# EasyEDA Pro project PowerManager.eprj

# Schematic Schematic1
Create Date: 2024-06-30; Page Name: P1; Project Name: PowerManager; Schematic Name: Schematic1; Update Date: 2024-07-01; Company: 嘉立创EDA; Page Size: A4; Version: V1.0
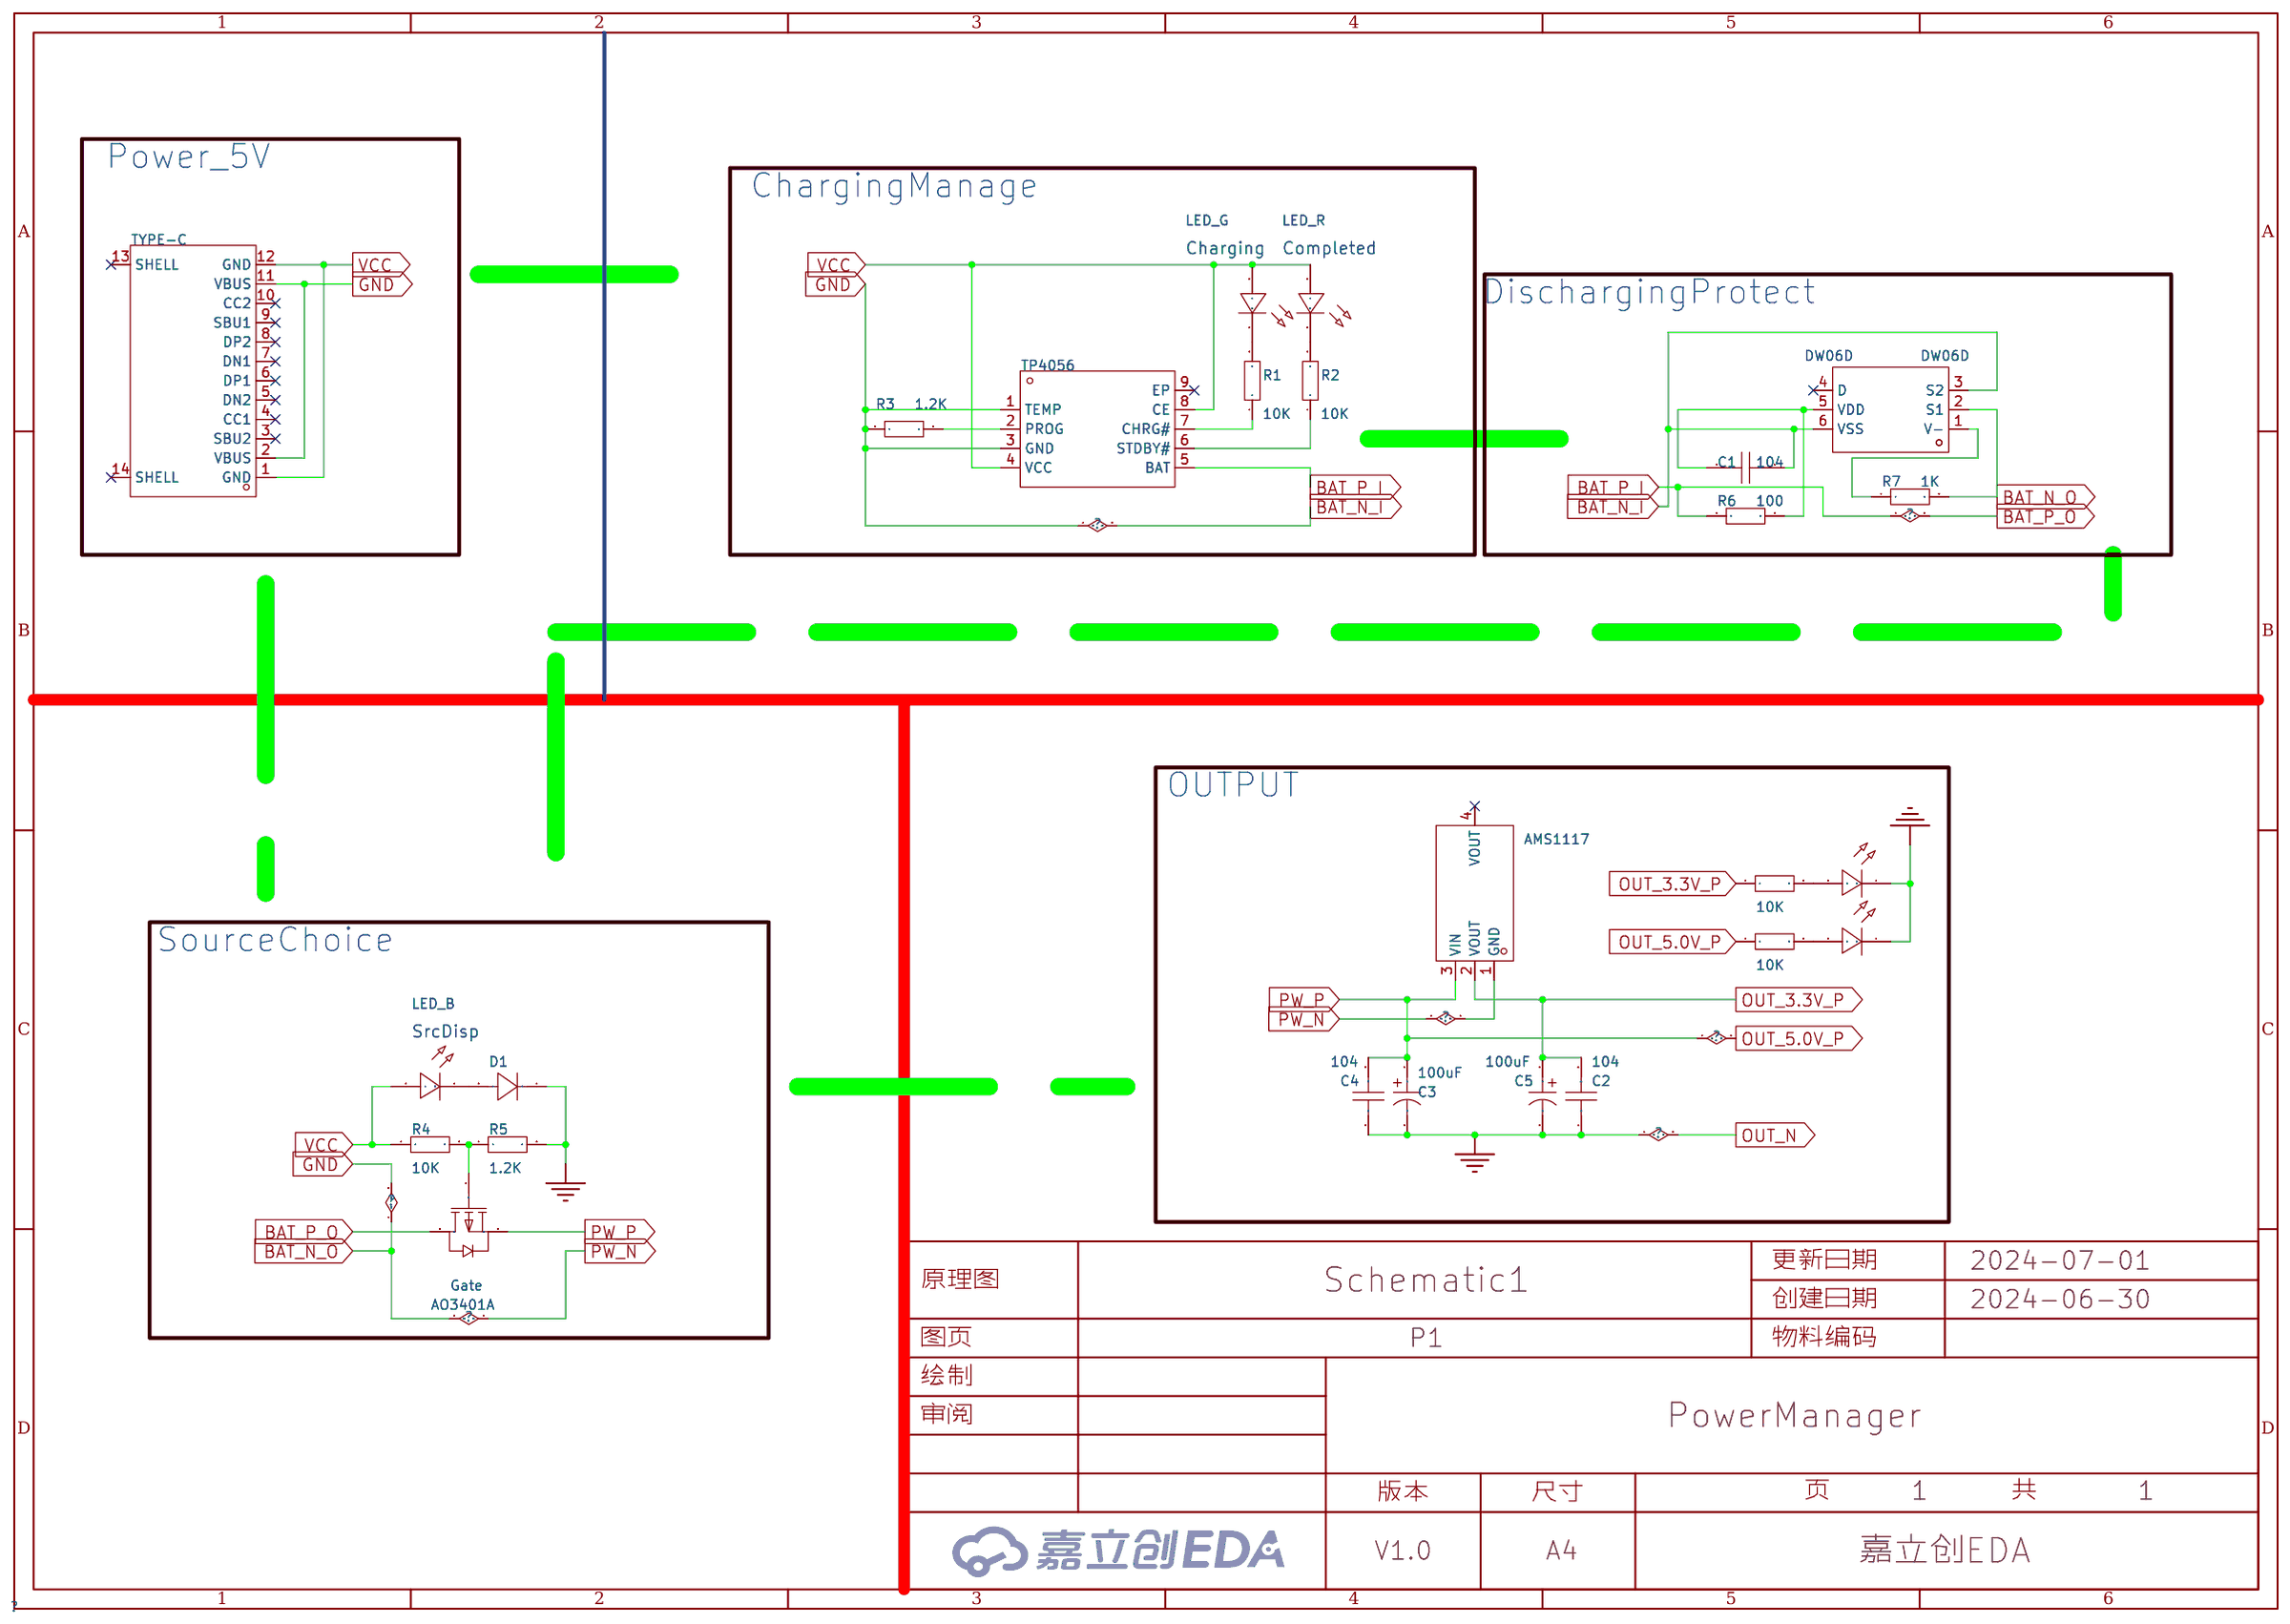
[diagram p0: schematic sheet]

## Parts
AMS1117  AMS1117  [SOT-223-3_L6.5-W3.4-P2.30-LS7.0-BR]
C1  104  [C0603]
C2  104  [C0603]
C3  100uF  [CAP-SMD_L7.3-W4.3-L-FD_EEFSX0E471E4]
C4  104  [C0603]
C5  100uF  [CAP-SMD_L7.3-W4.3-L-FD_EEFSX0E471E4]
Charging  LED_G  [LED_0603]
Completed  LED_R  [LED_0603]
D1  -  [SMA_1N4007]
DW06D  DW06D  [SOT-23-6_L2.9-W1.6-P0.95-LS2.8-BR]
Gate  AO3401A  [SOT-23_L2.9-W1.3-P1.90-LS2.4-BR]
LED1  -  [LED_0603]
LED2  -  [LED_0603]
R1  10K  [R0603]
R2  10K  [R0603]
R3  1.2K  [R0603]
R4  10K  [R0603]
R5  1.2K  [R0603]
R6  100  [R0603]
R7  1K  [R0603]
R8  10K  [R0603]
R9  10K  [R0603]
SrcDisp  LED_B  [LED_0603]
TP4056  TP4056  [ESOP-8_L4.9-W3.9-P1.27-LS6.0-BL-EP]
Type-C  TYPE-C  [USB-C-SMD_TYPE-C-6PIN-2MD-073]

## Library data of the parts
AMS1117 = AMS1117-3.3_C6186: 输出类型:固定;最大输入电压:-;输出电压:3.3V;最大输出电流:1A;电源纹波抑制比(PSRR):72dB@(120Hz);输出极性:正极;; LCSC Part Name: 输出3.3V 1A; Supplier Part: C6186; Manufacturer: AMS; Supplier Footprint: SOT-223; Datasheet: https://atta.szlcsc.com/upload/public/pdf/source/20180727/C6186_7A095716F0823C02F1997A905E26C086.pdf; Supplier: LCSC; Output Type: 固定; Output Voltage: 3.3V; MAX Output Current: 1A; Power Supply Rejection Ratio (PSRR): 72dB@(120Hz); Dropout Voltage: 1.3V@(800mA); Output Polarity: 正极; Number of Outputs: 1
C1 C2 C4 = CAP_0603: Supplier Footprint: 0603
C3 C5 = TR3D107K016C0150: 容值:100uF;精度:±10%;额定电压:16V;等效串联电阻:150mΩ;; LCSC Part Name: 100uF ±10% 16V; Supplier Part: C1953348; Manufacturer: VISHAY(威世); Supplier Footprint: CASE-D-7343-31(mm); Datasheet: https://atta.szlcsc.com/upload/public/pdf/source/20210424/D2589FD6E35F2EE55A4FE29C9A2BF604.pdf; Supplier: LCSC; Tolerance: ±10%; Rated Voltage: 16V; Equivalent Series Resistance(ESR): 150mΩ; Operating Temperature: -55℃~+125℃
Charging Completed LED1 LED2 SrcDisp = LED_0603-R: Supplier Footprint: 0603
D1 = D_1N4007: Supplier Footprint: SMA
DW06D = DW06D/J: 二合一锂电池保护 IC; Supplier Part: C82123; Manufacturer: FM(富满); Supplier Footprint: SOT-23-6; Datasheet: https://atta.szlcsc.com/upload/public/pdf/source/20160903/1472896624271.pdf; Supplier: LCSC
Gate = AO3401A_C15127: 类型:1个P沟道;漏源电压(Vdss):30V;连续漏极电流(Id):4A;功率(Pd):1.4W;导通电阻(RDS(on)@Vgs,Id):44mΩ@10V,4.3A;阈值电压(Vgs(th)@Id):1.3V@250uA;; LCSC Part Name: 1个P沟道 耐压:30V 电流:4A; Supplier Part: C15127; Manufacturer: AOS; Supplier Footprint: SOT-23; Datasheet: https://atta.szlcsc.com/upload/public/pdf/source/20160507/1462613609053.pdf; Supplier: LCSC; Type: 1个P沟道; Drain Source Voltage (Vdss): 30V; Continuous Drain Current (Id): 4A; Power Dissipation (Pd): 1.4W; Drain Source On Resistance (RDS(on)@Vgs,Id): 44mΩ@10V,4.3A; Gate Threshold Voltage (Vgs(th)@Id): 1.3V@250uA; Total Gate Charge (Qg@Vgs): 12.2nC@4.5V; Input Capacitance (Ciss@Vds): 1.2nF@15V; Operating Temperature: -55℃~+150℃@(Tj)
R1-R9 = Res_0603: Supplier Footprint: 0603
TP4056 = TP4056_C725790: Supplier Part: C725790; Manufacturer: UMW(友台半导体); Supplier Footprint: ESOP-8; Datasheet: https://atta.szlcsc.com/upload/public/pdf/source/20231109/CF74897CE79A500F7FE27A45ADCCC631.pdf; Supplier: LCSC
Type-C = TYPE-C 16PIN 2MD(073): 连接器类型:Type-C;标准:-;公母:母;端口数量:1;触点数量:16P;安装方式:卧贴;额定电流 - 电源:5A;工作温度范围:-25℃~+85℃;; LCSC Part Name: Type-C 母 卧贴; Supplier Part: C2765186; Manufacturer: SHOU HAN(首韩); Supplier Footprint: SMD; Datasheet: https://atta.szlcsc.com/upload/public/pdf/source/20211123/39B17C16241EAC15C5E277BDA434118E.pdf; Supplier: LCSC; Gender: 母; Number of Ports: 1; Number of Contacts: 16P; Mounting Style: 卧贴; Current Rating - Power (Max): 5A; Operating Temperature Range: -25℃~+85℃

## Nets
GND: AMS1117.1(GND) C1.1 C2.1 C3.2 C4.1 C5.2 D1.1(K) DW06D.2(S1) DW06D.3(S2) DW06D.6(VSS) LED1.1(C) LED2.1(C) R3.1 R5.2 R7.2 TP4056.1(TEMP) TP4056.3(GND) Type-C.2(VBUS) Type-C.11(VBUS)
VCC: Charging.2(A) Completed.2(A) R4.1 SrcDisp.2(A) TP4056.4(VCC) TP4056.8(CE) Type-C.1(GND) Type-C.12(GND)
BAT_P_I: Gate.3(D) R6.1 TP4056.5(BAT)
OUT_3.3V_P: AMS1117.2(VOUT) C2.2 C5.1 R8.1
OUT_5.0V_P: AMS1117.3(VIN) C3.1 C4.2 Gate.2(S) R9.1
$1N753: R3.2 TP4056.2(PROG)
$1N897: Completed.1(C) R2.2
$1N964: Charging.1(C) R1.2
$1N968: R1.1 TP4056.7(CHRG#)
$1N975: R2.1 TP4056.6(STDBY#)
$1N1874: Gate.1(G) R4.2 R5.1
$1N2995: DW06D.1(V-) R7.1
$1N3321: C1.2 DW06D.5(VDD) R6.2
$1N6420: D1.2(A) SrcDisp.1(C)
Net-(LED1-2): LED1.2(A) R8.2
Net-(LED2-2): LED2.2(A) R9.2

Not connected (* = marked no-connect by the designer): AMS1117 4(VOUT)*; DW06D 4(D)*; TP4056 9(EP)*; Type-C 3(SBU2)* 4(CC1)* 5(DN2)* 6(DP1)* 7(DN1)* 8(DP2)* 9(SBU1)* 10(CC2)* 13(SHELL)* 14(SHELL)*

## Notes on the sheet
- Power_5V
- ChargingManage
- DischargingProtect
- OUTPUT
- SourceChoice

# Board PCB1
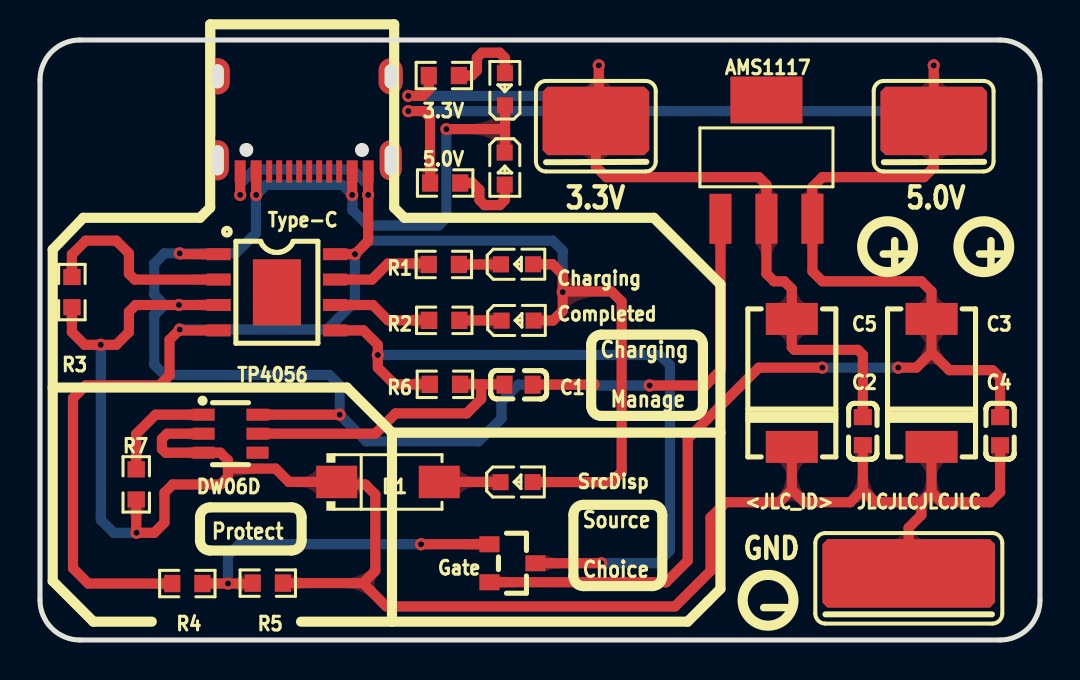
[diagram p1: board, top side]
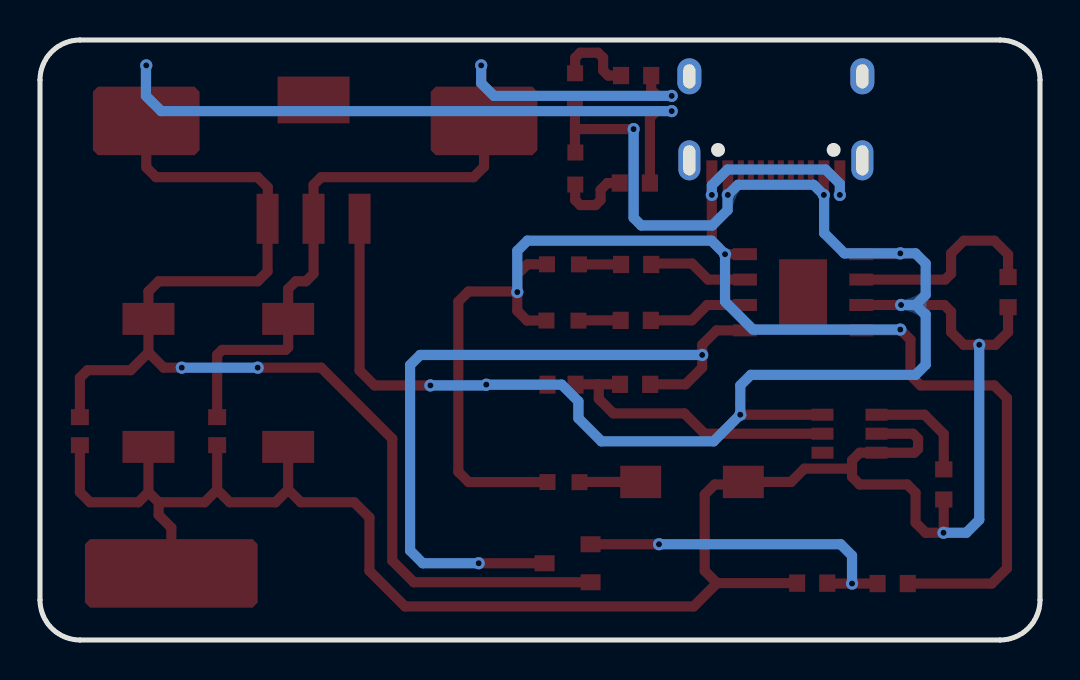
[diagram p2: board, bottom side, seen from below]

Outline 50 x 30 mm; copper layers: Top Layer, Bottom Layer. Coordinates in mm from the lower left corner of the outline.
Outline path: 0,28 0,2 arc(0.59,0.59) 2,0 48,0 arc(49.41,0.59) 50,2 50,28 arc(49.41,29.41) 48,30 2,30 arc(0.59,29.41) 0,28
Stack: Top Layer 0.035mm / Dielectric1 1.51mm FR4 er 4.5 / Bottom Layer 0.035mm

## Design rules (mm)
template: JLCPCB Capability(Two Layers Board)
spacing copperThickness1oz (default): track to track 0.102, other pairs 0.152 to 0.3
spacing copperThickness2oz: track to track 0.203, other pairs 0.152 to 0.3
track width copperThickness1oz (default): min 0.127, default 0.254, max 2.54
track width copperThickness2oz: min 0.203, default 0.254, max 2.54
differential pair differentialPair (default): width min 0.127, default 0.254, max 2.54; gap min 0.152, default 0.152
via viaSize (default): diameter min 0.5, default 0.61, max 10; hole min 0.3, default 0.305, max 6.3

## Placement (name value [footprint] x y rotation side)
3.3V  -  [LED_0603]  23.24 27.59 90 top
5.0V  -  [LED_0603]  23.24 23.52 270 top
AMS1117  AMS1117  [SOT-223-3_L6.5-W3.4-P2.30-LS7.0-BR]  36.32 24.03 270 top
C1  104  [C0603]  23.93 12.77 180 top
C2  104  [C0603]  41.14 10.44 90 top
C3  100uF  [CAP-SMD_L7.3-W4.3-L-FD_EEFSX0E471E4]  44.58 12.86 270 top
C4  104  [C0603]  48.01 10.44 90 top
C5  100uF  [CAP-SMD_L7.3-W4.3-L-FD_EEFSX0E471E4]  37.59 12.86 270 top
Charging  LED_G  [LED_0603]  23.9 18.79 0 top
Completed  LED_R  [LED_0603]  23.93 15.98 0 top
D1  -  [SMA_1N4007]  17.4 7.9 0 top
DW06D  DW06D  [SOT-23-6_L2.9-W1.6-P0.95-LS2.8-BR]  9.53 10.31 180 top
Gate  AO3401A  [SOT-23_L2.9-W1.3-P1.90-LS2.4-BR]  23.62 3.84 180 top
NOREF  -  [Pad_e75]  44.69 25.95 0 top
NOREF#2  -  [Pad_e67]  43.43 3.33 0 top
NOREF#3  -  [Pad_e86]  27.8 25.95 0 top
R1  10K  [R0603]  20.19 18.78 0 top
R2  10K  [R0603]  20.21 15.98 0 top
R3  1.2K  [R0603]  1.6 17.39 90 top
R4  10K  [R0603]  7.37 2.82 0 top
R5  1.2K  [R0603]  11.39 2.84 0 top
R6  100  [R0603]  20.25 12.78 0 top
R7  1K  [R0603]  4.81 7.78 270 top
R8  10K  [R0603]  20.19 28.22 0 top
R9  10K  [R0603]  20.26 22.85 0 top
SrcDisp  LED_B  [LED_0603]  23.88 7.9 0 top
TP4056  TP4056  [ESOP-8_L4.9-W3.9-P1.27-LS6.0-BL-EP]  11.85 17.39 270 top
Type-C  TYPE-C  [USB-C-SMD_TYPE-C-6PIN-2MD-073]  13.21 25.81 180 top

## Footprints (pads in the part's own frame, mm; a bottom-side part is the same pattern mirrored in y, then rotated)
C0603
  rect 0.8x0.9 smd: 1(-0.7,0) 2(0.7,0)
CAP-SMD_L7.3-W4.3-L-FD_EEFSX0E471E4
  rect 1.6x2.6 smd: 1(-3.2,0) 2(3.2,0)
ESOP-8_L4.9-W3.9-P1.27-LS6.0-BL-EP
  rect 0.6x1.2 smd: 1(-1.905,-2.909) 2(-0.635,-2.909) 3(0.635,-2.909) 4(1.905,-2.909) 5(1.905,2.909) 6(0.635,2.909) 7(-0.635,2.909) 8(-1.905,2.909)
  rect 3.3x2.4 smd: 9(0,0)
LED_0603
  rect 0.8x0.8 smd: 1(-0.851,-0.01) 2(0.75,-0.005)
Pad_e67
  custom 8.636x3.429 smd: 17(0,0)
Pad_e75
  custom 5.334x3.429 smd: 16(0,0)
Pad_e86
  custom 5.334x3.429 smd: 15(0,0)
R0603
  rect 0.806x0.864 smd: 1(-0.753,0) 2(0.753,0)
SMA_1N4007
  rect 2.046x1.62 smd: 1(-2.566,0) 2(2.566,0)
SOT-23-6_L2.9-W1.6-P0.95-LS2.8-BR
  rect 1.1x0.6 smd: 1(1.35,-0.95) 2(1.35,0) 3(1.35,0.95) 4(-1.35,0.95) 5(-1.35,0) 6(-1.35,-0.95)
SOT-23_L2.9-W1.3-P1.90-LS2.4-BR
  rect 1x0.8 smd: 1(1.15,-0.95) 2(1.15,0.95) 3(-1.15,0)
SOT-223-3_L6.5-W3.4-P2.30-LS7.0-BR
  rect 2.5x1.1 smd: 1(2.97,-2.3) 2(2.97,0) 3(2.97,2.3)
  rect 2.34x3.6 smd: 4(-2.97,0)
USB-C-SMD_TYPE-C-6PIN-2MD-073
  rect 0.55x1.1 smd: 1(-3.2,2.375) 2(-2.4,2.375) 11(2.4,2.375) 12(3.2,2.375)
  rect 0.3x1.1 smd: 3(-1.75,2.375) 4(-1.25,2.375) 5(-0.75,2.375) 6(-0.25,2.375) 7(0.25,2.375) 8(0.75,2.375) 9(1.25,2.375) 10(1.75,2.375)
  oval 1.1x2 hole 0.6x1.5: 13(-4.325,1.825) 14(4.325,1.825)
  oval 1.2x1.8 hole 0.6x1.2: 13(-4.325,-2.375) 14(4.325,-2.375)

## Nets
GND: 3.3V.1 5.0V.1 AMS1117.1 C1.1 C2.1 C3.2 C4.1 C5.2 D1.1 DW06D.2 DW06D.3 DW06D.6 NOREF#2.17 R3.1 R5.2 R7.2 TP4056.1 TP4056.3 Type-C.2 Type-C.11
VCC: Charging.2 Completed.2 R4.1 SrcDisp.2 TP4056.4 TP4056.8 Type-C.1 Type-C.12
BAT_P_I: Gate.3 R6.1 TP4056.5
OUT_3.3V_P: AMS1117.2 C2.2 C5.1 NOREF#3.15 R8.1
OUT_5.0V_P: AMS1117.3 C3.1 C4.2 Gate.2 NOREF.16 R9.1
$1N753: R3.2 TP4056.2
$1N897: Completed.1 R2.2
$1N964: Charging.1 R1.2
$1N968: R1.1 TP4056.7
$1N975: R2.1 TP4056.6
$1N1874: Gate.1 R4.2 R5.1
$1N2995: DW06D.1 R7.1
$1N3321: C1.2 DW06D.5 R6.2
$1N6420: D1.2 SrcDisp.1
$1N7526: 3.3V.2 R8.2
$1N7553: 5.0V.2 R9.2

Pads without a net: AMS1117 4; DW06D 4; TP4056 9; Type-C 3 4 5 6 7 8 9 10 13 14

## Via types
v1: diameter 0.61, hole 0.305, Top Layer to Bottom Layer, 25 vias

## Routing (per net, layer and track width the routed paths; a pad name or vN(x,y) marks a point on that pad's centre or on a via; arc(x,y) is an arc through that point)
GND: length 190
  Top Layer w0.508: 41.14,7.52 41.77,6.89 44.07,6.89 ; 41.14,7.52 40.51,6.89 38.23,6.89 37.59,7.52 ; 41.14,7.52 C2.1 ; v1(30.48,12.73) 33.27,12.73 34.02,13.48 AMS1117.1 ; 8.94,16.75 v1(6.95,16.75) 4.78,16.75 4.44,16.41 4.44,15.39 3.81,14.76 v1(3.04,14.76) 2.23,14.76 1.6,15.39 1.6,16.51 ; R7.2 4.81,5.38 v1(4.83,5.36) 5.72,5.36 6.22,5.87 6.22,7.36 6.64,7.78 9.02,7.78 9.4,8.16 9.4,8.57 ; 9.4,8.57 11.78,8.57 12.45,7.9 D1.1 14.96,7.78 16.26,7.78 16.76,7.28 16.76,3.46 16.15,2.84 ; 9.4,8.57 9.4,8.98 9.02,9.36 DW06D.3 6.28,9.36 6.1,9.55 6.1,10.06 6.35,10.31 DW06D.2 ; 37.59,7.52 36.96,6.89 34.29,6.89 33.53,6.12 33.53,3.46 31.75,1.68 17.31,1.68 16.15,2.84 ; 37.59,7.52 C5.2 ; C1.1 v1(27.69,12.77) ; NOREF#2.17 43.43,5.62 44.07,6.25 44.07,6.89 ; 3.3V.1 23.25,25.55 ; 23.25,25.55 v1(20.32,25.55) ; 23.25,25.55 23.25,24.39 5.0V.1 ; 16.15,2.84 R5.2 ; 44.58,7.39 C3.2 ; 44.58,7.39 44.07,6.89 ; 44.58,7.39 45.09,6.89 47.5,6.89 48.01,7.39 C4.1 ; Type-C.2 v1(15.61,22.25) ; v1(6.98,19.33) 7.03,19.29 8.94,19.29 ; v1(14.99,11.27) DW06D.6 ; Type-C.11 v1(10.81,22.25)
  Bottom Layer w0.508: v1(20.32,25.55) 20.32,21.11 19.94,20.73 16.38,20.73 15.62,21.49 15.62,22.24 v1(15.61,22.25) 15.1,22.76 11.32,22.76 v1(10.81,22.25) 10.79,22.24 10.79,20.35 9.78,19.33 v1(6.98,19.33) 6.22,19.33 5.72,18.82 5.72,17.26 6.22,16.75 ; v1(6.95,16.75) 6.22,16.75 ; 6.22,16.75 5.76,16.28 5.72,16.28 5.72,13.76 6.22,13.26 14.46,13.26 14.99,12.73 v1(14.99,11.27) 16.32,9.93 21.93,9.93 23.08,11.09 23.08,11.93 23.91,12.77 v1(27.69,12.77) 27.72,12.73 v1(30.48,12.73) ; v1(3.04,14.76) 3.04,6.01 3.68,5.36 v1(4.83,5.36)
VCC: length 84.4
  Top Layer w0.508: R4.1 2.41,2.82 1.65,3.58 1.65,12.09 2.29,12.73 5.97,12.73 6.48,13.24 6.48,15.01 v1(6.98,15.52) 7.03,15.48 8.94,15.48 ; v1(26.14,17.4) 26.14,18.28 25.63,18.79 Charging.2 ; v1(26.14,17.4) 26.14,16.46 25.65,15.97 Completed.2 ; v1(26.14,17.4) 26.17,17.43 28.57,17.43 29.08,16.92 29.08,8.41 28.57,7.9 SrcDisp.2 ; TP4056.8 v1(15.75,19.29) 16.41,19.95 v1(16.41,22.25) Type-C.1 ; Type-C.12 v1(10.01,22.25)
  Bottom Layer w0.508: v1(10.01,22.25) 10.01,22.81 10.72,23.52 15.62,23.52 16.41,22.74 v1(16.41,22.25) ; v1(26.14,17.4) 26.14,19.46 25.63,19.97 16.42,19.97 v1(15.75,19.29) 15.75,16.92 14.35,15.52 v1(6.98,15.52)
BAT_P_I: length 37.6
  Top Layer w0.508: TP4056.5 16.17,15.48 16.89,14.76 v1(16.89,14.25) 16.89,13.62 17.72,12.78 R6.1 ; v1(28.07,3.84) Gate.3
  Bottom Layer w0.508: v1(16.89,14.25) 30.99,14.25 31.5,13.74 31.5,4.47 30.86,3.84 v1(28.07,3.84)
OUT_3.3V_P: length 42.3
  Top Layer w0.508: C2.2 41.14,14.26 40.89,14.51 37.72,14.51 37.59,14.63 C5.1 37.59,17.55 37.21,17.94 36.7,17.94 36.32,18.32 AMS1117.2 36.32,22.76 35.94,23.14 28.32,23.14 27.8,23.67 NOREF#3.15 27.94,26.1 v1(27.94,28.73) ; R8.1 19.44,27.51 19.13,27.21 v1(18.41,27.21)
  Bottom Layer w0.508: v1(18.41,27.21) 27.31,27.21 27.94,27.84 v1(27.94,28.73)
OUT_5.0V_P: length 94.2
  Top Layer w0.508: Gate.2 31.31,2.89 32.38,3.97 32.38,10.06 35.94,13.62 v1(39.12,13.62) ; R9.1 19.5,26.12 19.18,26.44 v1(18.41,26.44) ; 44.58,14.38 43.81,13.62 v1(42.91,13.62) ; 44.58,14.38 45.47,13.49 47.62,13.49 48.01,13.11 C4.2 ; 44.58,14.38 C3.1 44.58,17.43 44.07,17.94 39.12,17.94 38.62,18.43 AMS1117.3 38.61,21.08 38.61,22.63 39.12,23.14 44.2,23.14 44.69,23.63 NOREF.16 v1(44.69,28.73)
  Bottom Layer w0.508: v1(39.12,13.62) v1(42.91,13.62) ; v1(18.41,26.44) 43.94,26.44 44.7,27.21 44.7,28.71 v1(44.69,28.73)
$1N753: length 10.3
  Top Layer w0.508: 8.94,18.02 4.74,18.02 4.44,18.32 4.44,19.33 3.81,19.97 2.29,19.97 1.6,19.28 1.6,18.02
$1N897: length 2.1
  Top Layer w0.508: Completed.1 23.06,15.98 R2.2
$1N964: length 2.1
  Top Layer w0.508: Charging.1 23.05,18.78 R1.2
$1N968: length 5
  Top Layer w0.508: TP4056.7 16.6,18.02 17.4,18.82 19.39,18.82 R1.1
$1N975: length 5
  Top Layer w0.508: R2.1 17.41,15.98 16.64,16.75 14.75,16.75
$1N1874: length 17.2
  Top Layer w0.508: R5.1 10.62,2.82 v1(9.4,2.82) R4.2 ; Gate.1 v1(19.05,4.79)
  Bottom Layer w0.508: v1(9.4,2.82) 9.4,4.22 9.97,4.79 v1(19.05,4.79)
$1N2995: length 5.5
  Top Layer w0.508: R7.1 4.81,10.3 5.78,11.27 DW06D.1
$1N3321: length 14.9
  Top Layer w0.508: 22.06,12.78 23.21,12.78 C1.2 ; 22.06,12.78 22.06,12.06 21.34,11.33 17.78,11.33 16.76,10.31 DW06D.5 ; 22.06,12.78 R6.2
$1N6420: length 3.1
  Top Layer w0.508: SrcDisp.1 23.01,7.9 D1.2
$1N7526: length 4
  Top Layer w0.508: 3.3V.2 23.24,28.34 23.24,29.11 22.99,29.36 22.1,29.36 21.84,29.11 21.84,28.48 21.59,28.22 R8.2
$1N7553: length 3.9
  Top Layer w0.508: 5.0V.2 23.24,22.77 23.24,22 22.99,21.75 22.22,21.75 21.97,22 21.97,22.51 21.63,22.85 21.01,22.85

## Copper pours and planes (outline as drawn; the poured copper is in the pictures)
GND on Top Layer: 0,30 50.29,30 50.29,-0.1 0,-0.1
GND on Bottom Layer: 0,30 50.29,30 50.29,-0.1 0,-0.1

Small or netless copper shapes (teardrops, artwork), in the pictures only: 85 on Top Layer, 5 on Bottom Layer

## Text on the board
Top Silkscreen Layer: <JLC_ID> | JLCJLCJLCJLC | Protect | Source / Choice | Charging / Manage | 3.3V | GND | 5.0V | - | +
